# EAGLE design controller2.5 (EAGLE 7.6.0)
CNAME: timebox controller; CREVISION: 1.0; DESIGNER: volzo
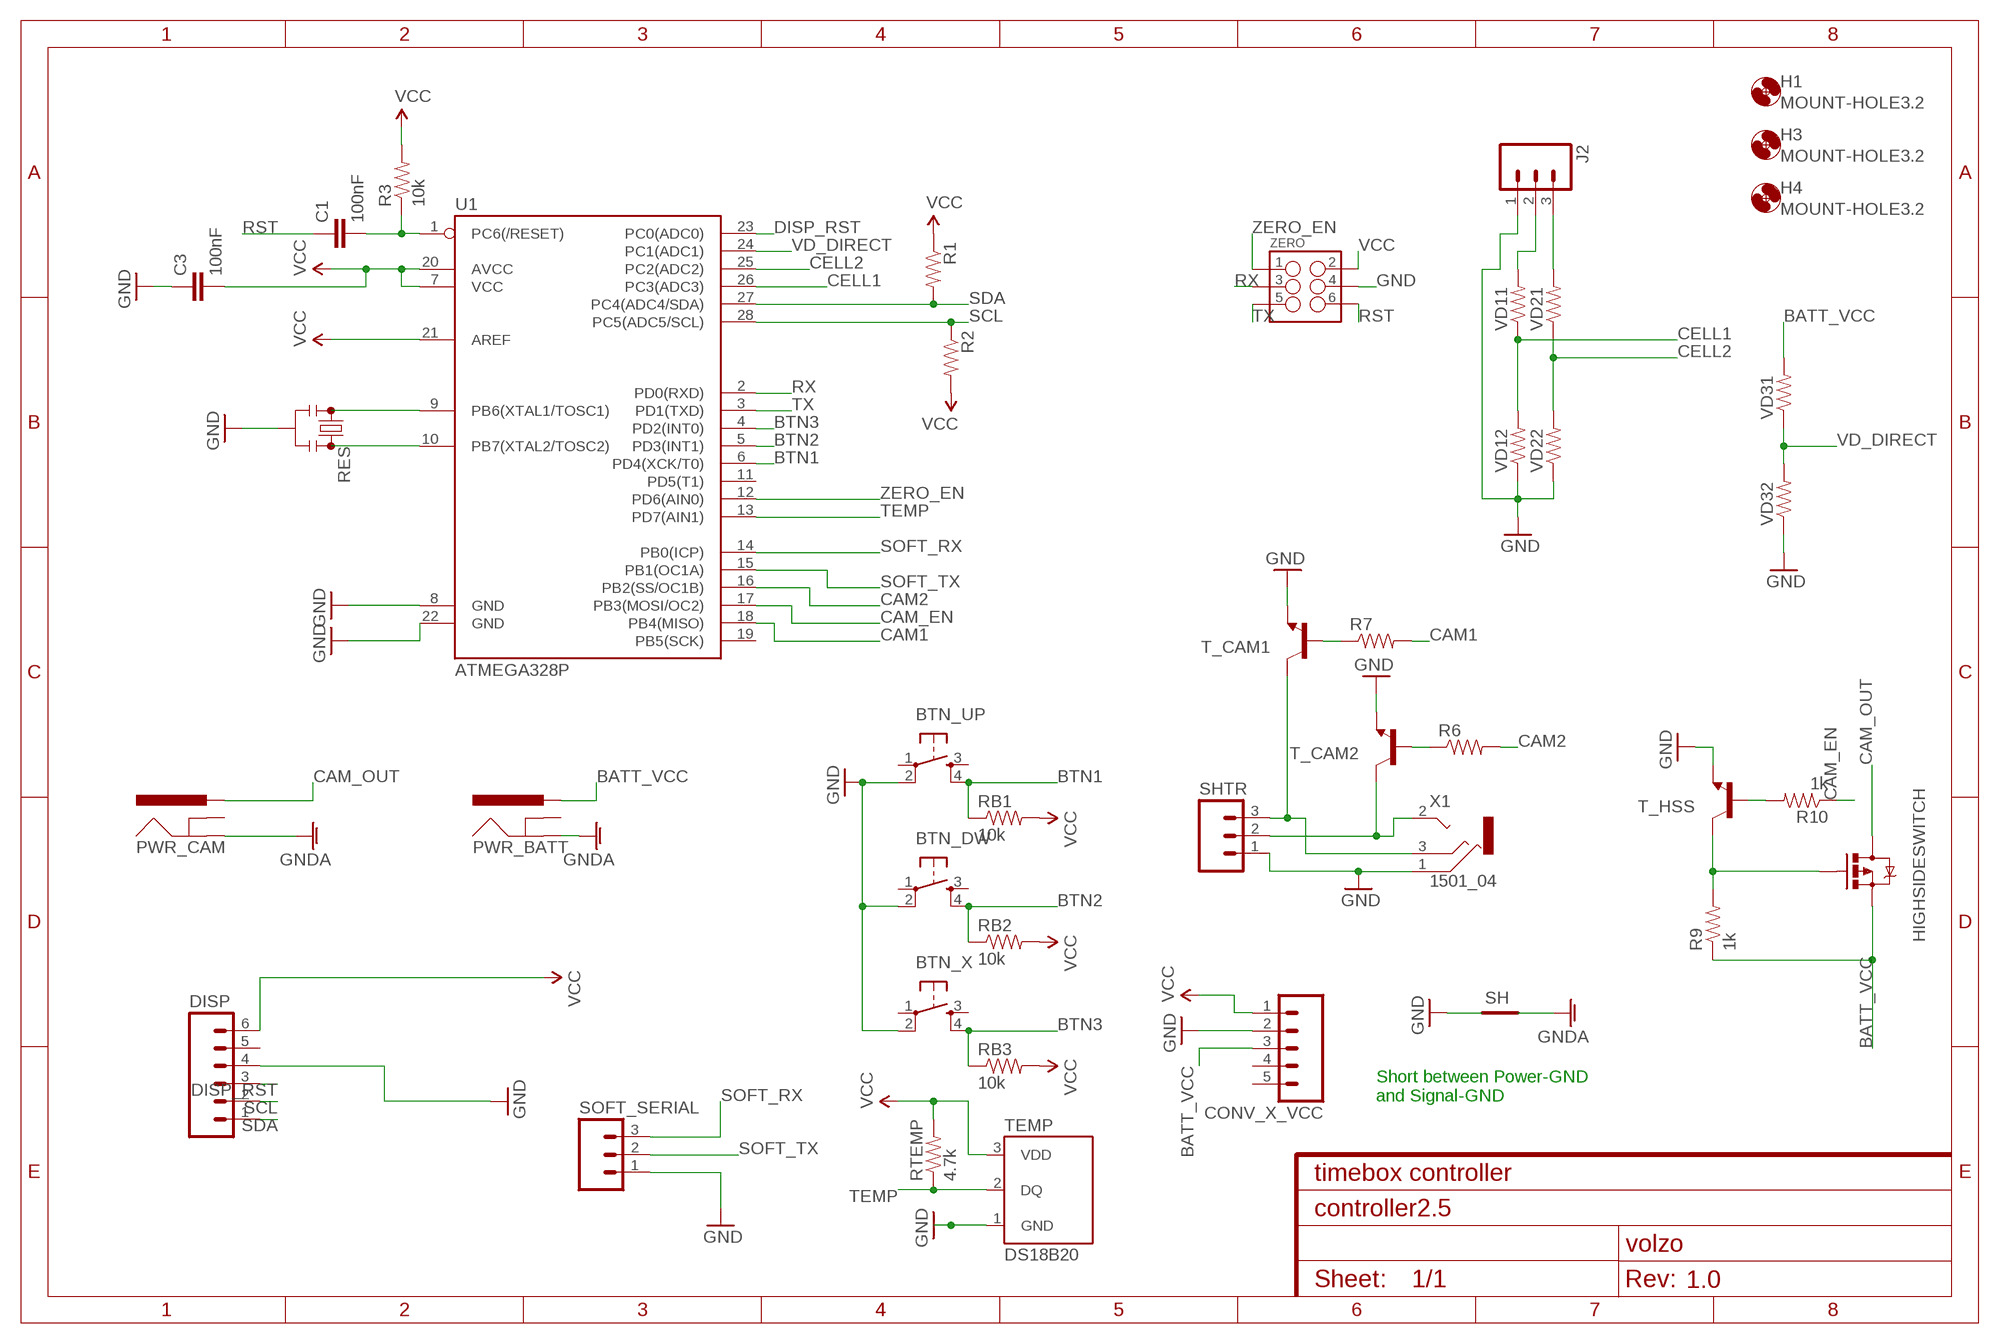
[diagram p0: schematic, sheet 1]

## Parts
BTN_DW  TAC_SWITCHPTH  [TACTILE-PTH]
BTN_UP  TAC_SWITCHPTH  [TACTILE-PTH]
BTN_X  TAC_SWITCHPTH  [TACTILE-PTH]
C1  100nF  CAPPTH  [CAP-PTH-SMALL]
C3  100nF  CAPPTH  [CAP-PTH-SMALL]
CONV_X_VCC  M05LOCK  [1X05_LOCK]
DISP  M06FEMALE_LOCK  [1X06_FEMALE_LOCK.010]
H1  MOUNT-HOLE3.2  [3,2]
H3  MOUNT-HOLE3.2  [3,2]
H4  MOUNT-HOLE3.2  [3,2]
HIGHSIDESWITCH  MOSFET-PCHANNELNDP6020P_20V_24A_LOW_VGS_TH  [TO220V]
J2  M03LOCK  [1X03_LOCK]
PWR_BATT  POWER_JACKPTH_BREAD  [POWER_JACK_PTH_BREAD]
PWR_CAM  POWER_JACKPTH_BREAD  [POWER_JACK_PTH_BREAD]
R1  RESISTORAXIAL-0.3  [AXIAL-0.3]
R2  RESISTORAXIAL-0.3  [AXIAL-0.3]
R3  10k  RESISTORAXIAL-0.3  [AXIAL-0.3]
R6  RESISTORAXIAL-0.3  [AXIAL-0.3]
R7  RESISTORAXIAL-0.3  [AXIAL-0.3]
R9  1k  RESISTORAXIAL-0.3  [AXIAL-0.3]
R10  1k  RESISTORAXIAL-0.3  [AXIAL-0.3]
RB1  10k  RESISTORAXIAL-0.3  [AXIAL-0.3]
RB2  10k  RESISTORAXIAL-0.3  [AXIAL-0.3]
RB3  10k  RESISTORAXIAL-0.3  [AXIAL-0.3]
RES  RESONATORPTH  [RESONATOR-PTH]
RTEMP  4.7k  RESISTORAXIAL-0.3  [AXIAL-0.3]
SH  SHORT-HT5  [SHORT_TOP-50]
SHTR  M03LOCK  [1X03_LOCK]
SOFT_SERIAL  M03LOCK  [1X03_LOCK]
T_CAM1  TRANSISTOR_NPN2N3904  [TO-92]
T_CAM2  TRANSISTOR_NPN2N3904  [TO-92]
T_HSS  TRANSISTOR_NPN2N3904  [TO-92]
TEMP  DS18B20  [TO-92-AMMO]
U1  ATMEGA328P  ATMEGA328P_PDIP  [DIL28-3]
VD11  RESISTORAXIAL-0.3  [AXIAL-0.3]
VD12  RESISTORAXIAL-0.3  [AXIAL-0.3]
VD21  RESISTORAXIAL-0.3  [AXIAL-0.3]
VD22  RESISTORAXIAL-0.3  [AXIAL-0.3]
VD31  RESISTORAXIAL-0.3  [AXIAL-0.3]
VD32  RESISTORAXIAL-0.3  [AXIAL-0.3]
X1  1501_04  [1501_05]
ZERO  M03X2FEMALE  [2X3]

## Nets
BATT_VCC [power]: CONV_X_VCC.3 HIGHSIDESWITCH.3(S) PWR_BATT.PWR R9.P$1 VD31.P$2
BTN1: BTN_UP.4 RB1.P$1 U1.6(PD4(XCK/T0))
BTN2: BTN_DW.4 RB2.P$1 U1.5(PD3(INT1))
BTN3: BTN_X.4 RB3.P$1 U1.4(PD2(INT0))
CAM1: R7.P$2 U1.18(PB4(MISO))
CAM2: R6.P$2 U1.16(PB2(SS/OC1B))
CAM_EN: R10.P$1 U1.17(PB3(MOSI/OC2))
CAM_OUT [power]: HIGHSIDESWITCH.2(D) PWR_CAM.PWR
CELL1: U1.26(PC3(ADC3)) VD11.P$1 VD12.P$2
CELL2: U1.25(PC2(ADC2)) VD21.P$1 VD22.P$2
DISP_RST: DISP.3 U1.23(PC0(ADC0))
GND: BTN_DW.2 BTN_UP.2 BTN_X.2 C3.1 CONV_X_VCC.2 DISP.4 J2.1 RES.2 SH.1 SHTR.1 SOFT_SERIAL.1 T_CAM1.1(E) T_CAM2.1(E) T_HSS.1(E) TEMP.1(GND) U1.8(GND) U1.22(GND) VD12.P$1 VD22.P$1 VD32.P$1 X1.1 ZERO.4
GNDA [power]: PWR_BATT.GND PWR_CAM.GND SH.2
N$1: C1.2 R3.P$1 U1.1(PC6(/RESET))
N$2: J2.2 VD11.P$2
N$3: R7.P$1 T_CAM1.2(B)
N$5: J2.3 VD21.P$2
N$7: SHTR.2 T_CAM2.3(C) X1.2
N$8: RES.3 U1.10(PB7(XTAL2/TOSC2))
N$9: RES.1 U1.9(PB6(XTAL1/TOSC1))
N$10: SHTR.3 T_CAM1.3(C) X1.3
N$11: R6.P$1 T_CAM2.2(B)
N$13: R10.P$2 T_HSS.2(B)
N$14: HIGHSIDESWITCH.1(G) R9.P$2 T_HSS.3(C)
RST: C1.1 ZERO.6
RX: U1.2(PD0(RXD)) ZERO.3
SCL: DISP.2 R2.P$1 U1.28(PC5(ADC5/SCL))
SDA: DISP.1 R1.P$2 U1.27(PC4(ADC4/SDA))
SOFT_RX: SOFT_SERIAL.3 U1.14(PB0(ICP))
SOFT_TX: SOFT_SERIAL.2 U1.15(PB1(OC1A))
TEMP: RTEMP.P$1 TEMP.2(DQ) U1.13(PD7(AIN1))
TX: U1.3(PD1(TXD)) ZERO.5
VCC: C3.2 CONV_X_VCC.1 DISP.6 R1.P$1 R2.P$2 R3.P$2 RB1.P$2 RB2.P$2 RB3.P$2 RTEMP.P$2 TEMP.3(VDD) U1.7(VCC) U1.20(AVCC) U1.21(AREF) ZERO.2
VD_DIRECT: U1.24(PC1(ADC1)) VD31.P$1 VD32.P$2
ZERO_EN: U1.12(PD6(AIN0)) ZERO.1
Unconnected: BTN_DW.1 BTN_DW.3 BTN_UP.1 BTN_UP.3 BTN_X.1 BTN_X.3 CONV_X_VCC.4 CONV_X_VCC.5 DISP.5 PWR_BATT.GNDBREAK PWR_CAM.GNDBREAK U1.11(PD5(T1)) U1.19(PB5(SCK))

## Notes on the sheet
- Short between Power-GND
  and Signal-GND

## Library data of the parts
BTN_DW BTN_UP BTN_X = SparkFun-Retired:TAC_SWITCH: Momentary Switch Button commonly used for reset or general input. Spark Fun Electronics SKU : COM-00097 SMT- SWCH-08247
C1 C3 = SparkFun-Passives:CAP: Capacitor Standard 0603 ceramic capacitor, and 0.1" leaded capacitor.
CONV_X_VCC = SparkFun-Connectors:M05: Header 5 Standard 5-pin 0.1" header. Use with straight break away headers (SKU : PRT-00116), right angle break away headers (PRT-00553), swiss pins (PRT-00743), machine pins (PRT-00117), and female headers (PRT-00115). Molex polarized connector foot print use with SKU : PRT-08230 with associated crimp pins and housings.
DISP = SparkFun-Connectors:M06: Header 6 Standard 6-pin 0.1" header. Use with straight break away headers (SKU : PRT-00116), right angle break away headers (PRT-00553), swiss pins (PRT-00743), machine pins (PRT-00117), and female headers (PRT-00115). Molex polarized connector foot print use with SKU : PRT-08094 with associated crimp pins and housings. NOTES ON THE VARIANTS LOCK and LOCK_LONGPADS... This footprint was designed to help hold the alignment of a through-hole component (i.e. 6-pin header) while soldering it into place. You may notice that each hole has been shifted either up or down by 0.005 of an inch from it's more standard position (which is a perfectly straight line). This slight alteration caused the pins (the squares in the middle) to touch the edges of the holes. Because they are alternating, it causes a "brace" to hold the component in place. 0.005 has proven to be the perfect amount of "off-center" position when using our standard breakaway headers. Although looks a little odd when you look at the bare footprint, once you have a header in there, the alteration is very hard to notice. Also,if you push a header all the way into place, it is covered up entirely on the bottom side. This idea of altering the position of holes to aid alignment will be further integrated into the Sparkfun Library for other footprints. It can help hold any component with 3 or more connection pins.
H1 H3 H4 = holes:MOUNT-HOLE: MOUNTING HOLE with drill center marker
HIGHSIDESWITCH = SparkFun-DiscreteSemi:MOSFET-PCHANNEL: Generic PMOSFET IRLML2244 - TRANS-11153 (SOT-23 -20V -4.3A) (1.Gate 2.Source 3.Drain) FQP27P06 - COM-10349 <http://www.sparkfun.com/products/10349> (TO-220 -60V -27A) (1.Gate 2.Source 3.Drain); PROD_ID: TRANS-13060
J2 SHTR SOFT_SERIAL = SparkFun-Connectors:M03: Header 3 Standard 3-pin 0.1" header. Use with straight break away headers (SKU : PRT-00116), right angle break away headers (PRT-00553), swiss pins (PRT-00743), machine pins (PRT-00117), and female headers (PRT-00115). Molex polarized connector foot print use with SKU : PRT-08232 with associated crimp pins and housings.
PWR_BATT PWR_CAM = SparkFun-Connectors:POWER_JACK: Power Jack This is the standard 5.5mm barrel jack for power. The PTH is the most common, proven, reliable, footprint. The Slot footprint only works if the mill layer is transmitted to the PCB fab house so be warned. Mating wall wart : TOL-00298 (and others); PROD_ID: PRT-10811
R1-R3 R6 R7 R9 R10 RB1-RB3 RTEMP VD11 VD12 VD21 VD22 VD31 VD32 = SparkFun-Resistors:RESISTOR: Resistor Basic schematic elements and footprints for 0603, 1206, and PTH resistors.
RES = SparkFun-FreqCtrl:RESONATOR: Resonator Small SMD resonator. Used, eg, on the Arduino Pro/ Pro Mini boards. 8MHz- XTAL-08895 16MHz- XTAL-08900
SH = shorts-old:SHORT-H: Short between two nets; BOM: no
T_CAM1 T_CAM2 T_HSS = SparkFun-DiscreteSemi:TRANSISTOR_NPN: Generic NPN BJT MMBT2222A - TRANS-08049 (SOT-23, 1A 40V) MPSA42 - TRANS-09116 (SOT-23, 500mA 300V) MMBT5088LT1G - TRANS-11160 (SOT-23, 50 mA 30V) BC547 - COM-08928 <http://www.sparkfun.com/products/8928> (TO-92 45V 100mA) (1.Collector 2.Base 3.Emitter) 2N3904 - COM-00521 <http://www.sparkfun.com/products/521> (TO-92 40V 200mA) (1.Emitter 2.Base 3.Collector) P2N2222A - COM-12852 <http://www.sparkfun.com/products/12852> (TO-92 40V 600mA) (1.Collector 2.Base 3.Emitter); PROD_ID: TRANS-08447
TEMP = SparkFun-Sensors:DS18B20: Dallas/Maxim DS18B20 1-wire temperature sensor Datasheet: http://datasheets.maximintegrated.com/en/ds/DS18B20.pdf temp thermometer 1-wire one-wire one wire; STORE_ID: SEN-00245
U1 = SparkFun-DigitalIC:ATMEGA328P_PDIP: uC used in the Arduino 32kb flash, 1k EEPROM, 2k SRAM This is the through-hole version of this chip.
X1 = con-lumberg:1501_0*: Jack connectors according to JISC 6560, 2.5 mm Klinkensteckverbinder nach JISC 6560, 2,5 mm Source: http://www.lumberg.com/Produkte/PDFs/1501_05.pdfedit 1501_03 http://www.lumberg.com/Produkte/PDFs/1501_06.pdf; OC_FARNELL: 1216977; OC_NEWARK: unknown
ZERO = SparkFun-Connectors:M03X2: 2x3 .1" header. Shrouded, with keying- CONN-10681 SMT- CONN-11415 Pogo pins- HW-11044; PROD_ID: CONN-11566; VALUE: FEMALE 2x3

## Net classes
0 default: width 0.305 mm, clearance 0.254 mm
1 power: width 0.762 mm, clearance 0.254 mm

## Board
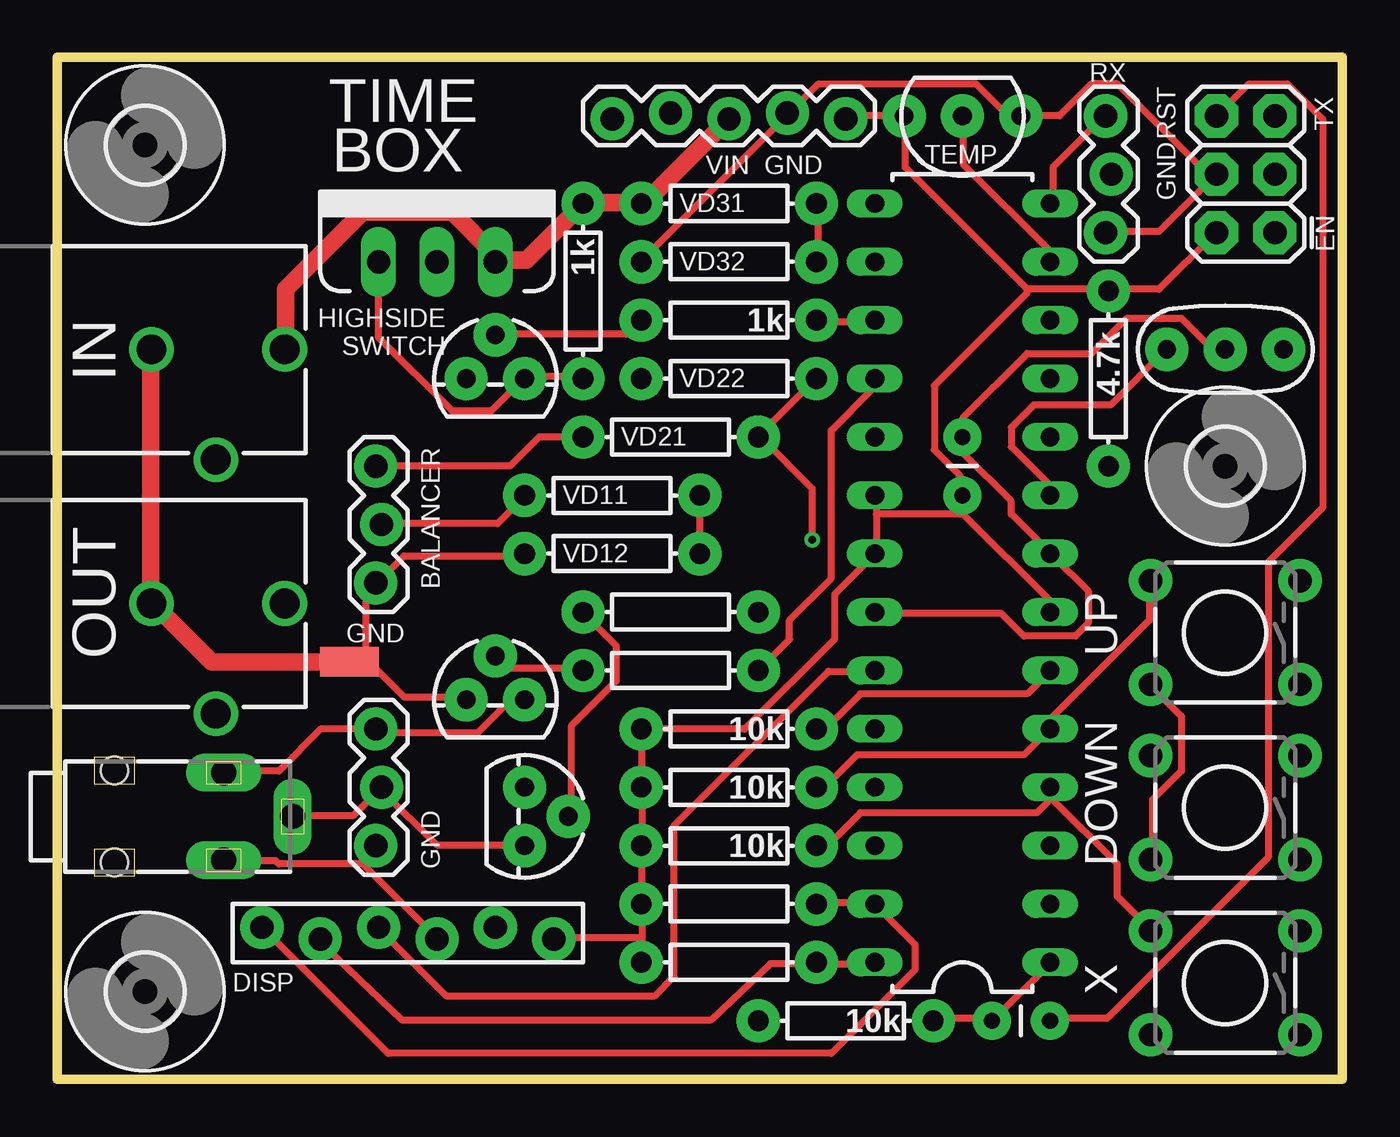
[diagram p1: board, top side]
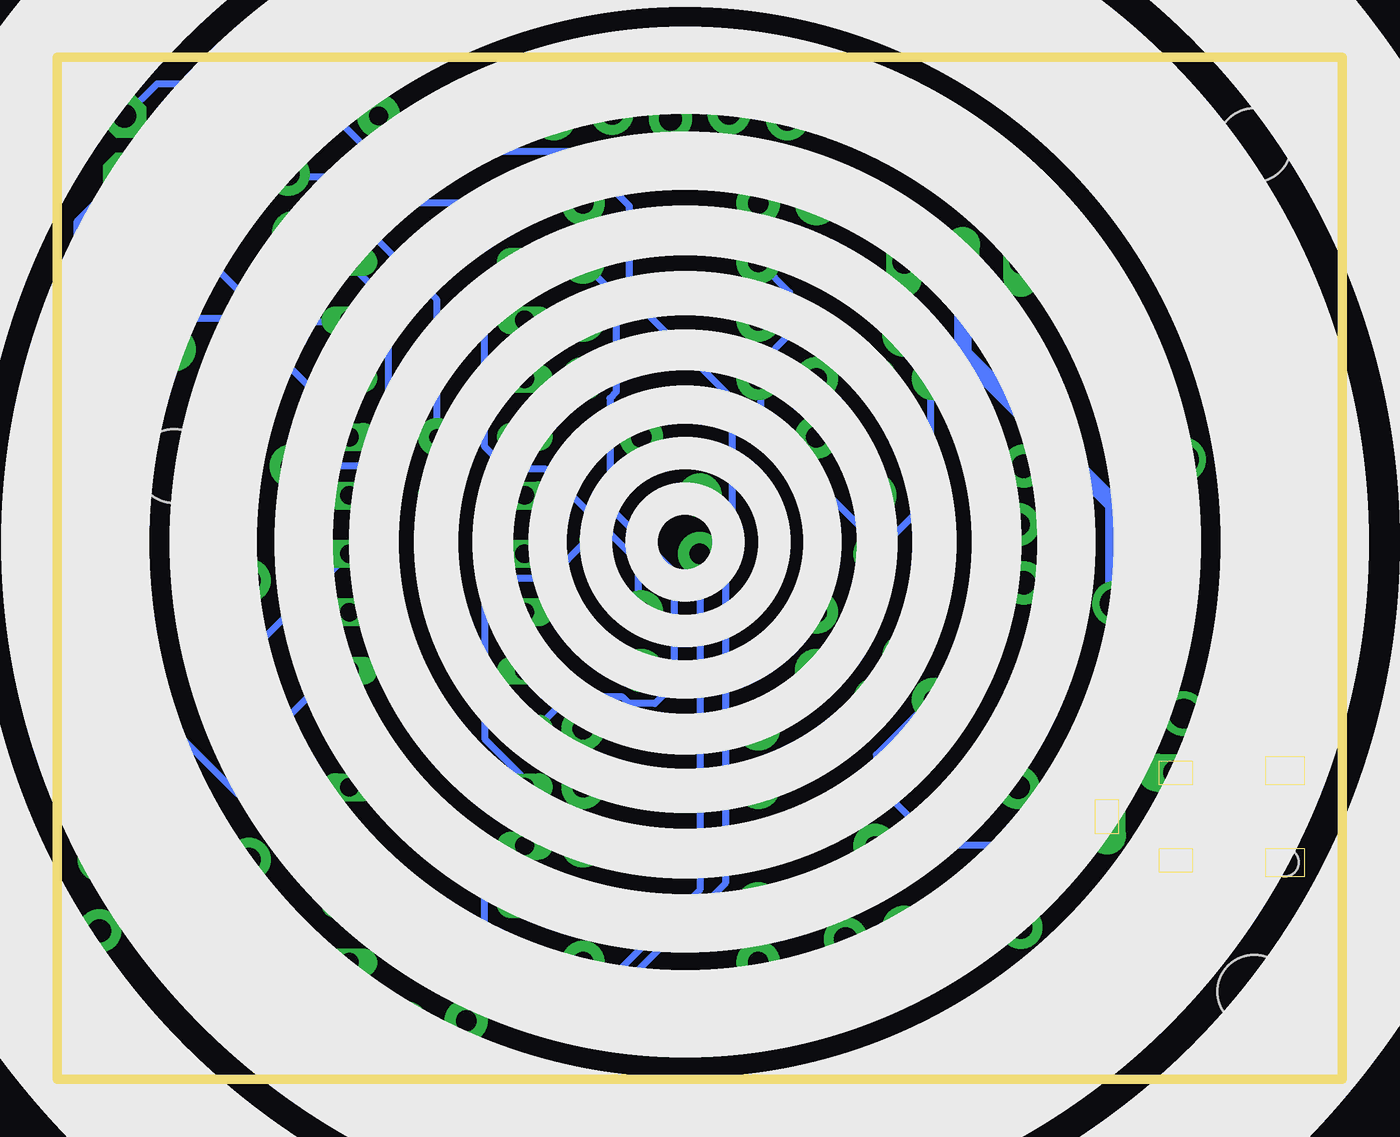
[diagram p2: board, bottom side, seen from below]

Size 55.88 x 44.45 mm. Coordinates in mm from the lower left corner, seen from the top.
Outline: 0,0 55.88,0 55.88,44.45 0,44.45 0,0
Copper layers (1*16): Top 0.0356mm / dielectric 1.5011mm / Bottom 0.0356mm
Design rules "oshpark-2layer *": minimum track width 6mil, minimum drill 13mil, track to track 10mil, track to pad 10mil, pad to pad 10mil, via to via 10mil, smd to smd 10mil, copper to edge 15mil, drill to drill 6mil, minimum pad ring 7mil, minimum via ring 7mil, stop-mask expansion 2.5mil, vias tented up to drill 0mil, thermal gap 10mil

### Footprints (pad centres in the part's own frame; a part is rotated, then mirrored left to right if it is on the bottom)
TACTILE-PTH = drill 1.016 pad 1.88: 1 -3.251,2.261; 2 3.251,2.261; 3 -3.251,-2.261; 4 3.251,-2.261
CAP-PTH-SMALL = drill 0.7 pad 1.651: 1 0,0; 2 2.54,0
1X05_LOCK = drill 1.016 pad 1.88: 1 0,0.127; 2 2.54,-0.127; 3 5.08,0.127; 4 7.62,-0.127; 5 10.16,0.127
1X06_FEMALE_LOCK.010 = drill 1.016 pad 1.88: 1 0,0.254; 2 2.54,-0.254; 3 5.08,0.254; 4 7.62,-0.254; 5 10.16,0.254; 6 12.7,-0.254
3,2 = hole 3.2: 0,0
TO220V = drill 1.016 long: 1 -2.54,0; 2 0,0; 3 2.54,0
1X03_LOCK = drill 1.016 pad 1.88: 1 0,0.127; 2 2.54,-0.127; 3 5.08,0.127
POWER_JACK_PTH_BREAD = drill 1.3: GND 0,7.9; GNDBREAK 4.8,10.7; PWR 0,13.7
AXIAL-0.3 = drill 0.9 pad 1.88: P$1 -3.81,0; P$2 3.81,0
RESONATOR-PTH = drill 0.8 pad 1.88: 1 -2.54,0; 2 0,0; 3 2.54,0
SHORT_TOP-50 = smd 1.27 x 1.27: 1 0.635,0; 2 -0.635,0
TO-92 = drill 0.813 pad 1.88: 1 -1.27,0; 2 0,1.905; 3 1.27,0
TO-92-AMMO = drill 0.813 pad 1.88: 1 -2.54,0; 2 0,0; 3 2.54,0
DIL28-3 = drill 0.813 long: 1 -16.51,-3.81; 2 -13.97,-3.81; 3 -11.43,-3.81; 4 -8.89,-3.81; 5 -6.35,-3.81; 6 -3.81,-3.81; 7 -1.27,-3.81; 8 1.27,-3.81; 9 3.81,-3.81; 10 6.35,-3.81; 11 8.89,-3.81; 12 11.43,-3.81; 13 13.97,-3.81; 14 16.51,-3.81; 15 16.51,3.81; 16 13.97,3.81; 17 11.43,3.81; 18 8.89,3.81; 19 6.35,3.81; 20 3.81,3.81; 21 1.27,3.81; 22 -1.27,3.81; 23 -3.81,3.81; 24 -6.35,3.81; 25 -8.89,3.81; 26 -11.43,3.81; 27 -13.97,3.81; 28 -16.51,3.81
1501_05 = drill 1.1 pad 1.4 long: 1 -1.9,-8.5; 2 0,-11.5; 3 1.9,-8.5 | hole 1.2: -2,-3.75; 2,-3.75
2X3 = drill 1.016 pad 1.88 octagon: 1 0,0; 2 0,2.54; 3 2.54,0; 4 2.54,2.54; 5 5.08,0; 6 5.08,2.54

### Placement (x,y rotation side)
BTN_DW  50.8,19.43 180 top
BTN_UP  50.8,11.81 180 top
BTN_X  50.8,4.19 180 top
C1  43.18,2.54 180 top
C3  39.37,27.94 270 top
CONV_X_VCC  34.29,41.91 180 top
DISP  8.89,6.35 0 top
H1  3.81,40.64 0 top
H3  50.8,26.67 0 top
H4  3.81,3.81 0 top
HIGHSIDESWITCH  16.51,35.56 0 top
J2  13.97,21.59 90 top
PWR_BATT  -3.81,31.75 270 top
PWR_CAM  -3.81,20.7 270 top
R1  29.21,7.62 0 top
R2  29.21,5.08 180 top
R3  34.29,2.54 180 top
R6  26.67,20.32 0 top
R7  26.67,17.78 0 top
R9  22.86,34.29 270 top
R10  29.21,33.02 180 top
RB1  29.21,15.24 180 top
RB2  29.21,12.7 180 top
RB3  29.21,10.16 180 top
RES  50.8,31.75 0 top
RTEMP  45.72,30.48 90 top
SH  12.7,18.16 0 top
SHTR  13.97,10.16 90 top
SOFT_SERIAL  45.72,36.83 90 top
T_CAM1  19.05,16.51 0 top
T_CAM2  20.32,11.43 270 top
T_HSS  19.05,30.48 0 top
TEMP  39.37,41.91 180 top
U1  39.37,21.59 90 top
VD11  24.13,25.4 180 top
VD12  24.13,22.86 0 top
VD21  26.67,27.94 180 top
VD22  29.21,30.48 0 top
VD31  29.21,38.1 180 top
VD32  29.21,35.56 0 top
X1  -1.27,11.43 90 top
ZERO  52.96,36.83 90 top

### Tracks (layer width: path | path; a pad name or v marks a point on that pad's centre or on a via)
BATT_VCC
  Top 0.762: CONV_X_VCC.3 25.7,38.28 VD31.P$2 25.29,38.14 23.19,38.14 R9.P$1 22.77,38 20.4,35.62 19.14,35.62 HIGHSIDESWITCH.3 19,35.9 17.18,37.72 13.27,37.72 9.92,34.37 9.92,31.85 PWR_BATT.PWR
BTN1
  Top 0.305: RB1.P$1 33.11,15.37 33.53,15.37 34.92,16.76 42.19,16.76 43.17,17.74 U1.6
  Bottom 0.305: U1.6 43.31,17.74 43.87,17.74 47.5,14.11 BTN_UP.4
BTN2
  Top 0.305: BTN_DW.4 47.5,21.65 47.5,19.98 43.31,15.79 43.31,15.37 U1.5 42.05,14.11 34.78,14.11 33.39,12.71 33.11,12.71 RB2.P$1
BTN3
  Top 0.305: BTN_X.4 47.5,6.57 46.1,7.96 46.1,9.36 43.31,12.15 43.31,12.57 U1.4 43.17,12.15 42.61,11.6 34.92,11.6 33.53,10.2 33.11,10.2 RB3.P$1
CAM1
  Top 0.305: U1.18 35.48,30.45 35.48,30.04 33.67,28.22 33.67,21.79 31.85,19.98 31.85,19.14 30.59,17.88 R7.P$2
CAM2
  Bottom 0.305: U1.16 35.62,35.48 35.62,35.06 37.3,33.39 37.3,27.52 36.32,26.54 34.65,26.54 30.59,22.49 30.59,20.4 R6.P$2
CAM_EN
  Top 0.305: U1.17 35.48,32.97 33.11,32.97 R10.P$1
CAM_OUT
  Bottom 0.762: HIGHSIDESWITCH.2 16.48,35.48 16.48,31.57 9.92,25.01 9.92,20.82 PWR_CAM.PWR
CELL1
  Top 0.305: VD12.P$2 VD11.P$1
  Bottom 0.305: VD12.P$2 27.94,8.24 32.55,3.63 36.18,3.63 37.3,4.75 37.3,7.96 35.62,9.64 35.62,10.06 U1.26
CELL2  (via drill 0.33)
  Top 0.305: v32.83,23.47 32.83,25.7 30.59,27.94 VD21.P$1 30.59,28.08 32.97,30.45 VD22.P$2
  Bottom 0.305: v32.83,23.47 34.51,21.79 36.18,21.79 37.3,20.68 37.3,14.81 35.62,13.13 35.62,12.71 U1.25
DISP_RST
  Top 0.305: U1.23 35.48,17.74 33.53,17.74 26.82,11.04 26.82,4.47 25.98,3.63 16.9,3.63 13.97,6.57 DISP.3
GND
  Top 0.305: U1.22 35.62,20.26 41.07,20.26 42.05,19.28 44.28,19.28 44.84,19.84 44.84,21.23 43.31,22.77 U1.8 43.17,22.91 41.49,24.59 41.49,25.15 39.4,27.24 39.4,27.94 C3.1 39.4,28.08 39.4,28.78 42.19,31.57 44.98,31.57 46.52,33.11 48.9,33.11 50.15,31.85 50.71,31.85 RES.2 | BTN_UP.2 47.64,9.64 47.64,12.15 48.9,13.41 48.9,15.79 47.64,17.04 BTN_DW.2 | SOFT_SERIAL.1 45.68,36.88 47.92,36.88 50.29,39.26 ZERO.4 50.15,39.26 46.1,43.31 44.98,43.31 43.59,41.91 TEMP.1 41.35,41.91 39.95,43.31 33.11,43.31 31.85,42.05 CONV_X_VCC.2 31.71,41.91 25.43,35.62 VD32.P$1 | 13.13,9.36 9.64,9.36 9.5,9.5 7.26,9.5 X1.1 | 13.13,9.36 13.83,10.06 SHTR.1 | DISP.4 16.48,6.15 13.27,9.36 13.13,9.36 | T_CAM1.1 17.74,16.62 15.09,16.62 13.55,18.16 SH.1 13.41,18.16 13.41,21.09 13.83,21.51 J2.1 13.97,21.65 15.09,22.77 20.26,22.77 VD12.P$1
  Bottom 0.305: BTN_X.2 47.64,1.96 47.64,4.61 48.9,5.87 48.9,8.24 47.64,9.5 BTN_UP.2 | BTN_DW.2 47.5,17.18 47.5,18.58 43.31,22.77 U1.8 | VD32.P$1 25.29,35.48 24.03,34.23 24.03,32.41 25.29,31.15 25.29,30.59 VD22.P$1 25.29,30.45 25.29,28.36 20.12,23.19 VD12.P$1 20.26,22.91 17.88,25.29 17.88,30.45 T_HSS.1 | T_CAM1.1 17.88,16.48 20.26,14.11 20.26,12.71 T_CAM2.1 20.12,12.71 17.6,10.2 13.97,10.2 SHTR.1 | C3.1 39.4,27.94 39.4,33.95 42.19,36.74 45.54,36.74 SOFT_SERIAL.1
GNDA
  Top 0.762: SH.2 6.71,18.16 4.19,20.68 PWR_CAM.GND 4.05,21.09 4.05,31.71 PWR_BATT.GND
N$1
  Top 0.305: U1.1 43.17,5.03 40.65,2.52 C1.2 40.51,2.65 38.14,2.65 R3.P$1
N$2
  Top 0.305: J2.2 14.11,24.17 19.14,24.17 20.26,25.29 VD11.P$2
N$3
  Top 0.305: R7.P$1 22.77,17.88 19.56,17.88 19.14,18.3 T_CAM1.2
N$5
  Top 0.305: VD21.P$2 20.95,27.94 19.7,26.68 13.97,26.68 J2.3
N$7
  Top 0.305: X1.2 10.34,11.46 12.85,11.46 SHTR.2 14.11,12.57 16.48,10.2 20.26,10.2 T_CAM2.3
N$8
  Bottom 0.305: U1.10 43.31,27.94 43.31,28.5 46.8,31.99 46.8,32.27 47.64,33.11 51.97,33.11 53.23,31.85 RES.3
N$9
  Top 0.305: U1.9 43.17,25.43 43.17,25.84 41.49,27.52 41.49,28.36 42.47,29.34 45.82,29.34 48.2,31.71 RES.1
N$10
  Top 0.305: X1.3 7.26,13.41 9.64,13.41 11.46,15.23 13.83,15.23 SHTR.3 13.83,15.09 18.3,15.09 19.7,16.48 20.26,16.48 T_CAM1.3
N$11
  Top 0.305: T_CAM2.2 22.35,11.46 22.35,15.37 24.31,17.32 24.31,18.86 22.91,20.26 R6.P$1
N$13
  Top 0.305: T_HSS.2 19.14,32.41 24.73,32.41 25.29,32.97 R10.P$2
N$14
  Top 0.305: HIGHSIDESWITCH.1 13.97,32.27 17.18,29.06 18.86,29.06 20.26,30.45 T_HSS.3 20.4,30.59 22.77,30.59 R9.P$2
RST
  Top 0.305: C1.1 43.31,2.65 45.68,2.65 52.67,9.64 52.67,22.49 55.04,24.87 55.04,41.77 53.51,43.31 51.83,43.31 50.43,41.91 ZERO.6
RX
  Bottom 0.305: U1.2 43.31,7.68 52.67,17.04 52.67,22.49 55.04,24.87 55.04,37.3 53.09,39.26 ZERO.3
SCL
  Top 0.305: U1.28 35.48,5.03 33.11,5.03 R2.P$1 32.97,5.03 31.01,5.03 28.42,2.56 15,2.56 12.19,5.25 11.46,6.01 DISP.2
SDA
  Top 0.305: R1.P$2 33.11,7.68 35.48,7.68 U1.27 35.62,7.54 37.3,5.87 37.3,4.75 33.67,1.12 14.39,1.12 8.94,6.57 DISP.1
SOFT_RX
  Top 0.305: U1.14 43.31,38.14 43.31,39.67 45.54,41.91 SOFT_SERIAL.3
SOFT_TX
  Bottom 0.305: U1.15 35.62,38.14 41.07,38.14 42.19,39.26 45.82,39.26 SOFT_SERIAL.2
TEMP
  Top 0.305: U1.13 43.17,35.62 43.17,36.04 39.4,39.81 39.4,41.91 TEMP.2
  Bottom 0.305: RTEMP.P$1 45.68,26.68 42.33,26.68 41.49,27.52 41.49,33.81 43.17,35.48 U1.13
TX
  Bottom 0.305: U1.3 43.17,10.06 43.17,9.78 36.46,3.07 32.27,3.07 26.82,8.52 26.82,22.07 26.54,22.35 26.54,29.62 31.01,34.09 31.01,38 33.39,40.37 42.33,40.37 44.15,42.19 44.15,42.47 44.98,43.31 51.55,43.31 52.95,41.91 ZERO.5
VCC
  Top 0.305: 25.43,6.15 25.43,7.54 R1.P$1 25.43,7.68 25.43,10.06 RB3.P$2 25.43,10.2 25.43,12.57 RB2.P$2 25.43,12.85 25.43,15.23 RB1.P$2 25.57,15.23 29.9,15.23 33.81,19.14 33.81,21.09 35.48,22.77 U1.21 35.62,22.91 35.62,24.59 | 25.43,6.15 25.43,5.17 R2.P$2 | 25.43,6.15 21.65,6.15 DISP.6 | 35.62,24.59 35.62,25.29 U1.20 | U1.7 43.17,20.4 43.17,20.82 39.4,24.59 39.4,25.29 C3.2 | 35.62,24.59 39.26,24.59 C3.2 | CONV_X_VCC.1 34.37,41.91 TEMP.3 36.88,41.77 36.88,39.67 42.19,34.37 | ZERO.2 50.29,36.74 47.92,34.37 45.82,34.37 RTEMP.P$2 45.68,34.37 42.19,34.37 | C3.2 39.26,25.43 39.26,26.26 38.14,27.38 38.14,30.18 42.19,34.23 42.19,34.37
  Bottom 0.305: R3.P$2 30.45,2.65 27.8,2.65 25.43,5.03 R2.P$2
VD_DIRECT
  Top 0.305: VD31.P$1 33.11,38 33.11,35.62 VD32.P$2
  Bottom 0.305: U1.24 35.48,15.37 34.92,15.37 33.67,16.62 31.29,16.62 31.01,16.34 29.9,16.34 29.06,17.18 29.06,22.07 31.85,24.87 31.85,29.62 31.57,29.9 31.57,34.09 32.97,35.48 VD32.P$2
ZERO_EN
  Bottom 0.305: U1.12 43.31,32.97 45.12,32.97 45.26,32.83 46.52,32.83 49.17,35.48 51.69,35.48 52.95,36.74 ZERO.1

### Text on the board
tPlace: TIME | RX | BOX | TEMP | RST | TX | VIN | GND | VD31 | GND | EN | VD32 | HIGHSIDE / SWITCH | IN | VD22 | VD21 | VD11 | VD12 | BALANCER | GND | OUT | UP | GND | DOWN | DISP | X